# EasyEDA Pro project grandPA2.eprj, schematic main
Board Name: main; Create Date: 2026-07-16; Page Name: P1; Project Name: grandPA2; Schematic Name: main; Update Date: 2026-07-21; Company: EasyEDA.com; Page Size: A4; Version: v0.2
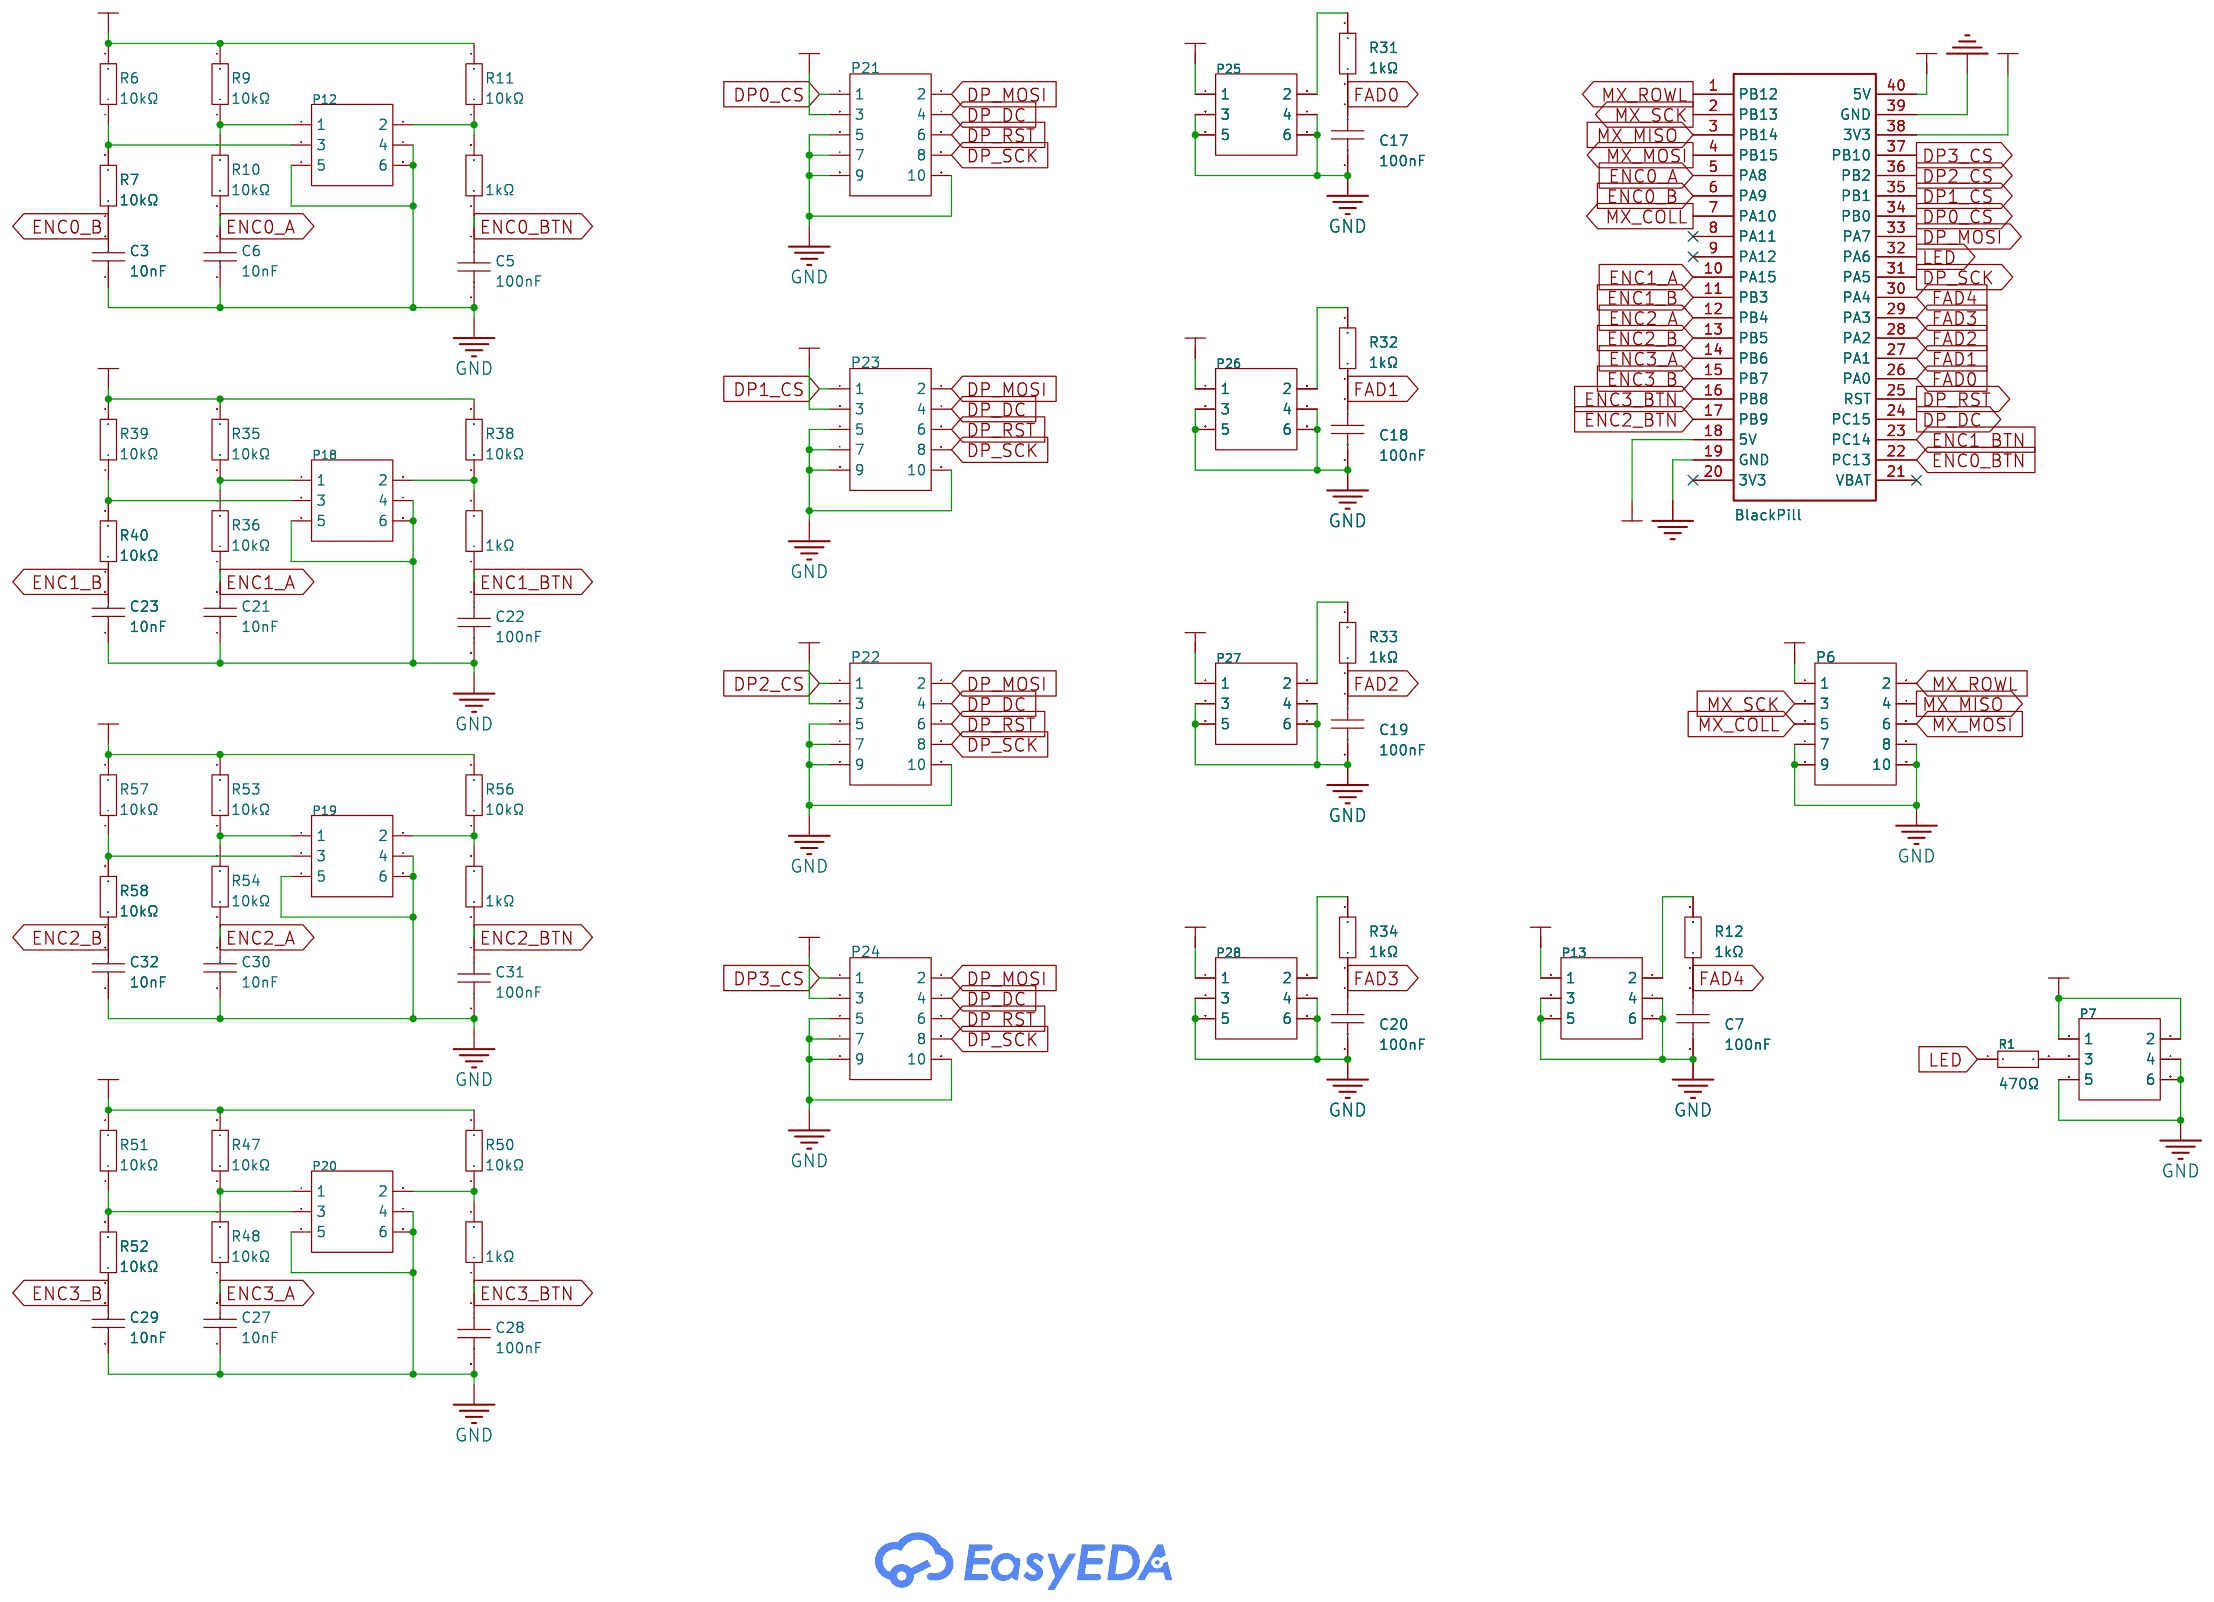
[diagram p2: schematic sheet]

## Parts
C3  10nF  [C0402]
C5  100nF  [C0402]
C6  10nF  [C0402]
C7  100nF  [C0402]
C17  100nF  [C0402]
C18  100nF  [C0402]
C19  100nF  [C0402]
C20  100nF  [C0402]
C21  10nF  [C0402]
C22  100nF  [C0402]
C23  10nF  [C0402]
C27  10nF  [C0402]
C28  100nF  [C0402]
C29  10nF  [C0402]
C30  10nF  [C0402]
C31  100nF  [C0402]
C32  10nF  [C0402]
P6  2.54-2*5P简牛  [IDC-TH_10P-P2.54_C5665]
P7  2.54-2*3P简牛  [IDC-TH_6P-P2.54_C11214]
P12  2.54-2*3P简牛  [IDC-TH_6P-P2.54_C11214]
P13  2.54-2*3P简牛  [IDC-TH_6P-P2.54_C11214]
P18  2.54-2*3P简牛  [IDC-TH_6P-P2.54_C11214]
P19  2.54-2*3P简牛  [IDC-TH_6P-P2.54_C11214]
P20  2.54-2*3P简牛  [IDC-TH_6P-P2.54_C11214]
P21  2.54-2*5P简牛  [IDC-TH_10P-P2.54_C5665]
P22  2.54-2*5P简牛  [IDC-TH_10P-P2.54_C5665]
P23  2.54-2*5P简牛  [IDC-TH_10P-P2.54_C5665]
P24  2.54-2*5P简牛  [IDC-TH_10P-P2.54_C5665]
P25  2.54-2*3P简牛  [IDC-TH_6P-P2.54_C11214]
P26  2.54-2*3P简牛  [IDC-TH_6P-P2.54_C11214]
P27  2.54-2*3P简牛  [IDC-TH_6P-P2.54_C11214]
P28  2.54-2*3P简牛  [IDC-TH_6P-P2.54_C11214]
R1  470Ω  [R0402]
R5  1kΩ  [R0402]
R6  10kΩ  [R0402]
R7  10kΩ  [R0402]
R9  10kΩ  [R0402]
R10  10kΩ  [R0402]
R11  10kΩ  [R0402]
R12  1kΩ  [R0402]
R31  1kΩ  [R0402]
R32  1kΩ  [R0402]
R33  1kΩ  [R0402]
R34  1kΩ  [R0402]
R35  10kΩ  [R0402]
R36  10kΩ  [R0402]
R37  1kΩ  [R0402]
R38  10kΩ  [R0402]
R39  10kΩ  [R0402]
R40  10kΩ  [R0402]
R47  10kΩ  [R0402]
R48  10kΩ  [R0402]
R49  1kΩ  [R0402]
R50  10kΩ  [R0402]
R51  10kΩ  [R0402]
R52  10kΩ  [R0402]
R53  10kΩ  [R0402]
R54  10kΩ  [R0402]
R55  1kΩ  [R0402]
R56  10kΩ  [R0402]
R57  10kΩ  [R0402]
R58  10kΩ  [R0402]
U1  BlackPill  [Z_module_black_pill_STM32F411]

## Library data of the parts
C3 C6 C21 C23 C27 C29 C30 C32 = CL05B103KB5NNNC: LCSC Part Name: 10nF ±10% 50V; Supplier Part: C15195; Manufacturer: SAMSUNG(三星); Supplier Footprint: 0402; JLCPCB Part Class: Basic Part; Datasheet: https://item.szlcsc.com/datasheet/CL05B103KB5NNNC/15869.html; Supplier: LCSC; Tolerance: ±10%; Voltage Rating: 50V; Temperature Coefficient: X7R
C5 C7 C17-C20 C22 C28 C31 = CL05B104KO5NNNC: LCSC Part Name: 100nF ±10% 16V; Supplier Part: C1525; Manufacturer: SAMSUNG(三星); Supplier Footprint: 0402; JLCPCB Part Class: Basic Part; Datasheet: https://item.szlcsc.com/datasheet/CL05B104KO5NNNC/1877.html; Supplier: LCSC; Tolerance: ±10%; Voltage Rating: 16V; Temperature Coefficient: X7R
P6 P21-P24 = 2.54-2*5P简牛: LCSC Part Name: 2.54mm 2x5P 排数:2 每排P数:5; Supplier Part: C5665; Manufacturer: BOOMELE(博穆精密); Supplier Footprint: 插件,P=2.54mm; JLCPCB Part Class: Extended Part; Supplier: LCSC; Connector Type: IDC Header; Pitch: 2.54mm; Number of Positions or Pins: 2x5P; Current Rating: 1A; Holder Type: Through Hole; Row Spacing: 2.54mm; Number of Rows: 2; Number of PINs Per Row: 5; Contact Material: Brass; Contact Plating: Gold; Operating Temperature: -55℃~+105℃; Color: Black
P7 P12 P13 P18-P20 P25-P28 = 2.54-2*3P简牛: LCSC Part Name: 2.54mm 2x3P 排数:2 每排P数:3; Supplier Part: C11214; Manufacturer: BOOMELE(博穆精密); Supplier Footprint: 插件,P=2.54mm; JLCPCB Part Class: Extended Part; Datasheet: https://item.szlcsc.com/datasheet/2.54-2*3P%25E7%25AE%2580%25E7%2589%259B/11763.html; Supplier: LCSC; Connector Type: IDC Header; Pitch: 2.54mm; Number of Positions or Pins: 2x3P; Current Rating: 1A; Holder Type: Through Hole; Row Spacing: 2.54mm; Number of Rows: 2; Number of PINs Per Row: 3; Contact Material: Brass; Contact Plating: Gold; Operating Temperature: -55℃~+105℃; Color: Black
R1 = 0402WGF4700TCE: LCSC Part Name: 470Ω ±1% 62.5mW 厚膜电阻; Supplier Part: C25117; Manufacturer: UNI-ROYAL(厚声); Supplier Footprint: 0402; JLCPCB Part Class: Basic Part; Datasheet: https://item.szlcsc.com/datasheet/0402WGF4700TCE/25860.html; Supplier: LCSC; Type: Thick Film Resistor; Tolerance: ±1%; Power(Watts): 62.5mW; Voltage-Supply(Max): 50V; Temperature Coefficient: ±100ppm/℃; Operating Temperature: -55℃~+155℃
R5 R12 R31-R34 R37 R49 R55 = 0402WGF1001TCE: LCSC Part Name: 1kΩ ±1% 62.5mW 厚膜电阻; Supplier Part: C11702; Manufacturer: UNI-ROYAL(厚声); Supplier Footprint: 0402; JLCPCB Part Class: Basic Part; Datasheet: https://item.szlcsc.com/datasheet/0402WGF1001TCE/12256.html; Supplier: LCSC; Type: Thick Film Resistor; Tolerance: ±1%; Power(Watts): 62.5mW; Voltage-Supply(Max): 50V; Temperature Coefficient: ±100ppm/℃; Operating Temperature: -55℃~+155℃
R6 R7 R9-R11 R35 R36 R38-R40 R47 R48 R50-R54 R56-R58 = 0402WGF1002TCE: Type:Thick Film Resistor Resistance:10kΩ Tolerance:±1% Tolerance:±1% Power(Watts):62.5mW Voltage-Supply(Max):50V Temperature Coefficient:±100ppm/℃ Temperature Coefficient:±100ppm/℃ Operating Temperature:-55℃~+155℃ Operating Temperature:-55℃~+155℃; LCSC Part Name: 10kΩ ±1% 62.5mW 厚膜电阻; Supplier Part: C25744; Manufacturer: UNI-ROYAL(厚声); Supplier Footprint: 0402; JLCPCB Part Class: Basic Part; Datasheet: https://item.szlcsc.com/datasheet/0402WGF1002TCE/26487.html; Supplier: LCSC; Type: Thick Film Resistor; Tolerance: ±1%; Power(Watts): 62.5mW; Voltage-Supply(Max): 50V; Temperature Coefficient: ±100ppm/℃; Operating Temperature: -55℃~+155℃
U1 = YAAJ_BlackPill

## Nets
3V3: P6.1 P13.1 P21.3 P22.3 P23.3 P24.3 P25.1 P26.1 P27.1 P28.1 R6.2 R9.2 R11.2 R35.2 R38.2 R39.2 R47.2 R50.2 R51.2 R53.2 R56.2 R57.2 U1.38(3V3)
5V: P7.1 P7.2 U1.18(5V) U1.40(5V)
GND: C3.1 C5.2 C6.1 C7.2 C17.2 C18.2 C19.2 C20.2 C21.1 C22.2 C23.1 C27.1 C28.2 C29.1 C30.1 C31.2 C32.1 P6.7 P6.8 P6.9 P6.10 P7.4 P7.5 P7.6 P12.4 P12.5 P12.6 P13.3 P13.4 P13.5 P13.6 P18.4 P18.5 P18.6 P19.4 P19.5 P19.6 P20.4 P20.5 P20.6 P21.5 P21.7 P21.9 P21.10 P22.5 P22.7 P22.9 P22.10 P23.5 P23.7 P23.9 P23.10 P24.5 P24.7 P24.9 P24.10 P25.3 P25.4 P25.5 P25.6 P26.3 P26.4 P26.5 P26.6 P27.3 P27.4 P27.5 P27.6 P28.3 P28.4 P28.5 P28.6 U1.19(GND) U1.39(GND)
DP0_CS: P21.1 U1.34(PB0)
DP1_CS: P23.1 U1.35(PB1)
DP2_CS: P22.1 U1.36(PB2)
DP3_CS: P24.1 U1.37(PB10)
DP_DC: P21.4 P22.4 P23.4 P24.4 U1.24(PC15)
DP_MOSI: P21.2 P22.2 P23.2 P24.2 U1.33(PA7)
DP_RST: P21.6 P22.6 P23.6 P24.6 U1.25(RST)
DP_SCK: P21.8 P22.8 P23.8 P24.8 U1.31(PA5)
ENC0_A: C6.2 R10.1 U1.5(PA8)
ENC0_B: C3.2 R7.1 U1.6(PA9)
ENC0_BTN: C5.1 R5.1 U1.22(PC13)
ENC1_A: C21.2 R36.1 U1.10(PA15)
ENC1_B: C23.2 R40.1 U1.11(PB3)
ENC1_BTN: C22.1 R37.1 U1.23(PC14)
ENC2_A: C30.2 R54.1 U1.12(PB4)
ENC2_B: C32.2 R58.1 U1.13(PB5)
ENC2_BTN: C31.1 R55.1 U1.17(PB9)
ENC3_A: C27.2 R48.1 U1.14(PB6)
ENC3_B: C29.2 R52.1 U1.15(PB7)
ENC3_BTN: C28.1 R49.1 U1.16(PB8)
FAD0: C17.1 R31.1 U1.26(PA0)
FAD1: C18.1 R32.1 U1.27(PA1)
FAD2: C19.1 R33.1 U1.28(PA2)
FAD3: C20.1 R34.1 U1.29(PA3)
FAD4: C7.1 R12.1 U1.30(PA4)
LED: R1.1 U1.32(PA6)
MX_COLL: P6.5 U1.7(PA10)
MX_MISO: P6.4 U1.3(PB14)
MX_MOSI: P6.6 U1.4(PB15)
MX_ROWL: P6.2 U1.1(PB12)
MX_SCK: P6.3 U1.2(PB13)
$1N4893: P12.1 R9.1 R10.2
$1N6245: P12.3 R6.1 R7.2
$1N10974: P26.2 R32.2
$1N11636: P7.3 R1.2
$1N15576: P12.2 R5.2 R11.1
$1N18301: P18.3 R39.1 R40.2
$1N18313: P18.1 R35.1 R36.2
$1N18314: P18.2 R37.2 R38.1
$1N19975: P20.3 R51.1 R52.2
$1N19978: P20.1 R47.1 R48.2
$1N19980: P20.2 R49.2 R50.1
$1N20351: P19.3 R57.1 R58.2
$1N20354: P19.1 R53.1 R54.2
$1N20356: P19.2 R55.2 R56.1
$1N32435: P25.2 R31.2
$1N32458: P28.2 R34.2
$1N32469: P27.2 R33.2
$1N32477: P13.2 R12.2

Not connected (* = marked no-connect by the designer): U1 8(PA11)* 9(PA12)* 20(3V3)* 21(VBAT)*
